# EAGLE design EasyDriverTip122 (EAGLE 7.2.0)
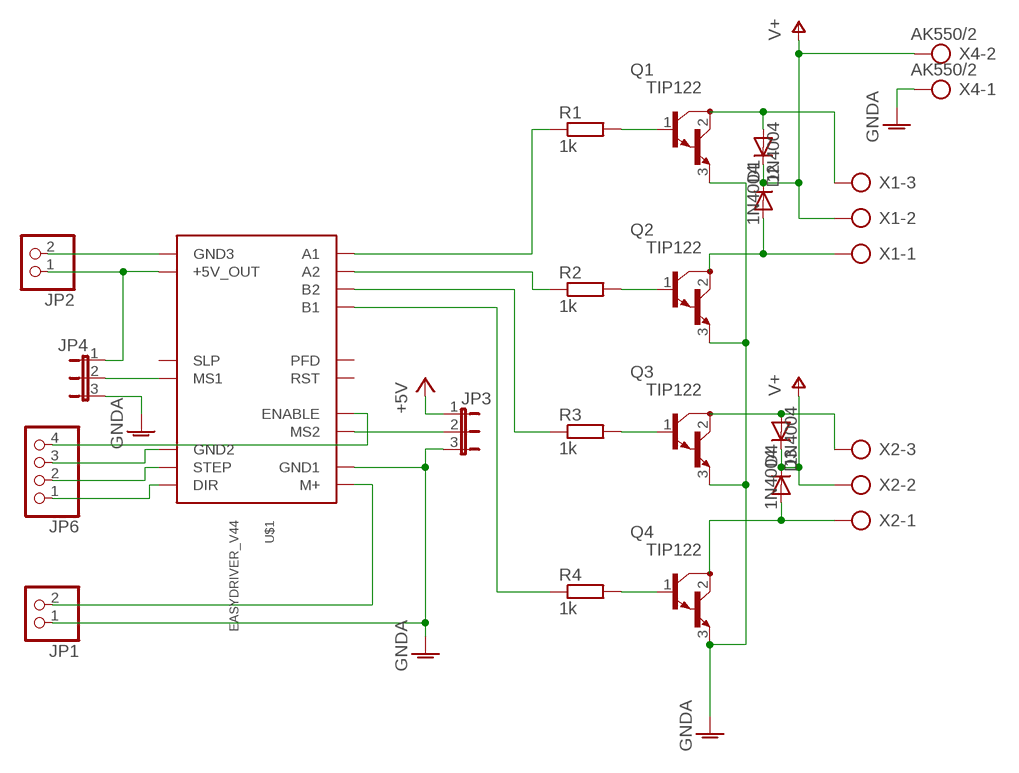
[diagram p0: schematic, sheet 1]

## Parts
D1  1N4004  [DO41-10]
D2  1N4004  [DO41-10]
D3  1N4004  [DO41-10]
D4  1N4004  [DO41-10]
JP1  PINHD-1X2  [1X02]
JP2  PINHD-1X2  [1X02]
JP3  JP2E  [JP2]
JP4  JP2E  [JP2]
JP6  PINHD-1X4  [1X04]
Q1  TIP122  [TO220V]
Q2  TIP122  [TO220V]
Q3  TIP122  [TO220V]
Q4  TIP122  [TO220V]
R1  1k  R-EU_0204/7  [0204/7]
R2  1k  R-EU_0204/7  [0204/7]
R3  1k  R-EU_0204/7  [0204/7]
R4  1k  R-EU_0204/7  [0204/7]
U$1  EASYDRIVER_V44  [EASYDRIVER_V44]
X1  AK500/3  [AK500/3]
X2  AK500/3  [AK500/3]
X4  AK550/2  [AK550/2]

## Nets
+5V: JP2.1 JP3.1 JP4.1 U$1.P$11(+5V_OUT)
GNDA: JP1.1 JP3.3 JP4.3 Q1.3(E) Q2.3(E) Q3.3(E) Q4.3(E) U$1.GND1 X4.1
N$1: JP4.2 U$1.MS1
N$2: JP3.2 U$1.MS2
N$3: JP6.3 U$1.GND2
N$4: JP6.2 U$1.STEP
N$5: JP6.4 U$1.ENABLE
N$6: JP1.2 U$1.M+
N$7: JP2.2 U$1.GND3
N$8: JP6.1 U$1.DIR
N$9: Q1.1(B) R1.2
N$10: Q2.1(B) R2.2
N$11: Q3.1(B) R3.2
N$12: Q4.1(B) R4.2
N$13: R1.1 U$1.A1
N$14: R2.1 U$1.A2
N$15: R3.1 U$1.B2
N$16: R4.1 U$1.B1
N$17: D2.A Q1.2(C) X1.3
N$18: D1.A Q2.2(C) X1.1
N$19: D3.A Q3.2(C) X2.3
N$20: D4.A Q4.2(C) X2.1
V+: D1.C D2.C D3.C D4.C X1.2 X2.2 X4.2
Unconnected: U$1.PFD U$1.RST U$1.SLEEP(SLP)

## Library data of the parts
D1-D4 = diode:1N4004: DIODE general purpose rectifier, 1 A
JP1 JP2 = pinhead:PINHD-1X2: PIN HEADER
JP3 JP4 = jumper:JP2E: JUMPER
JP6 = pinhead:PINHD-1X4: PIN HEADER
Q1-Q4 = transistor-npn:TIP122*: NPN Darlington Transistor
R1-R4 = resistor:R-EU_: RESISTOR, European symbol
U$1 = EasyDriver:EASYDRIVER_V44: EasyDriver version 4.4 - http://www.schmalzhaus.com/EasyDriver
X1 X2 = con-ptr500:AK500/3: CONNECTOR; OC_FARNELL: unknown; OC_NEWARK: unknown
X4 = con-ptr500:AK550/2: CONNECTOR; OC_FARNELL: unknown; OC_NEWARK: unknown

## Board
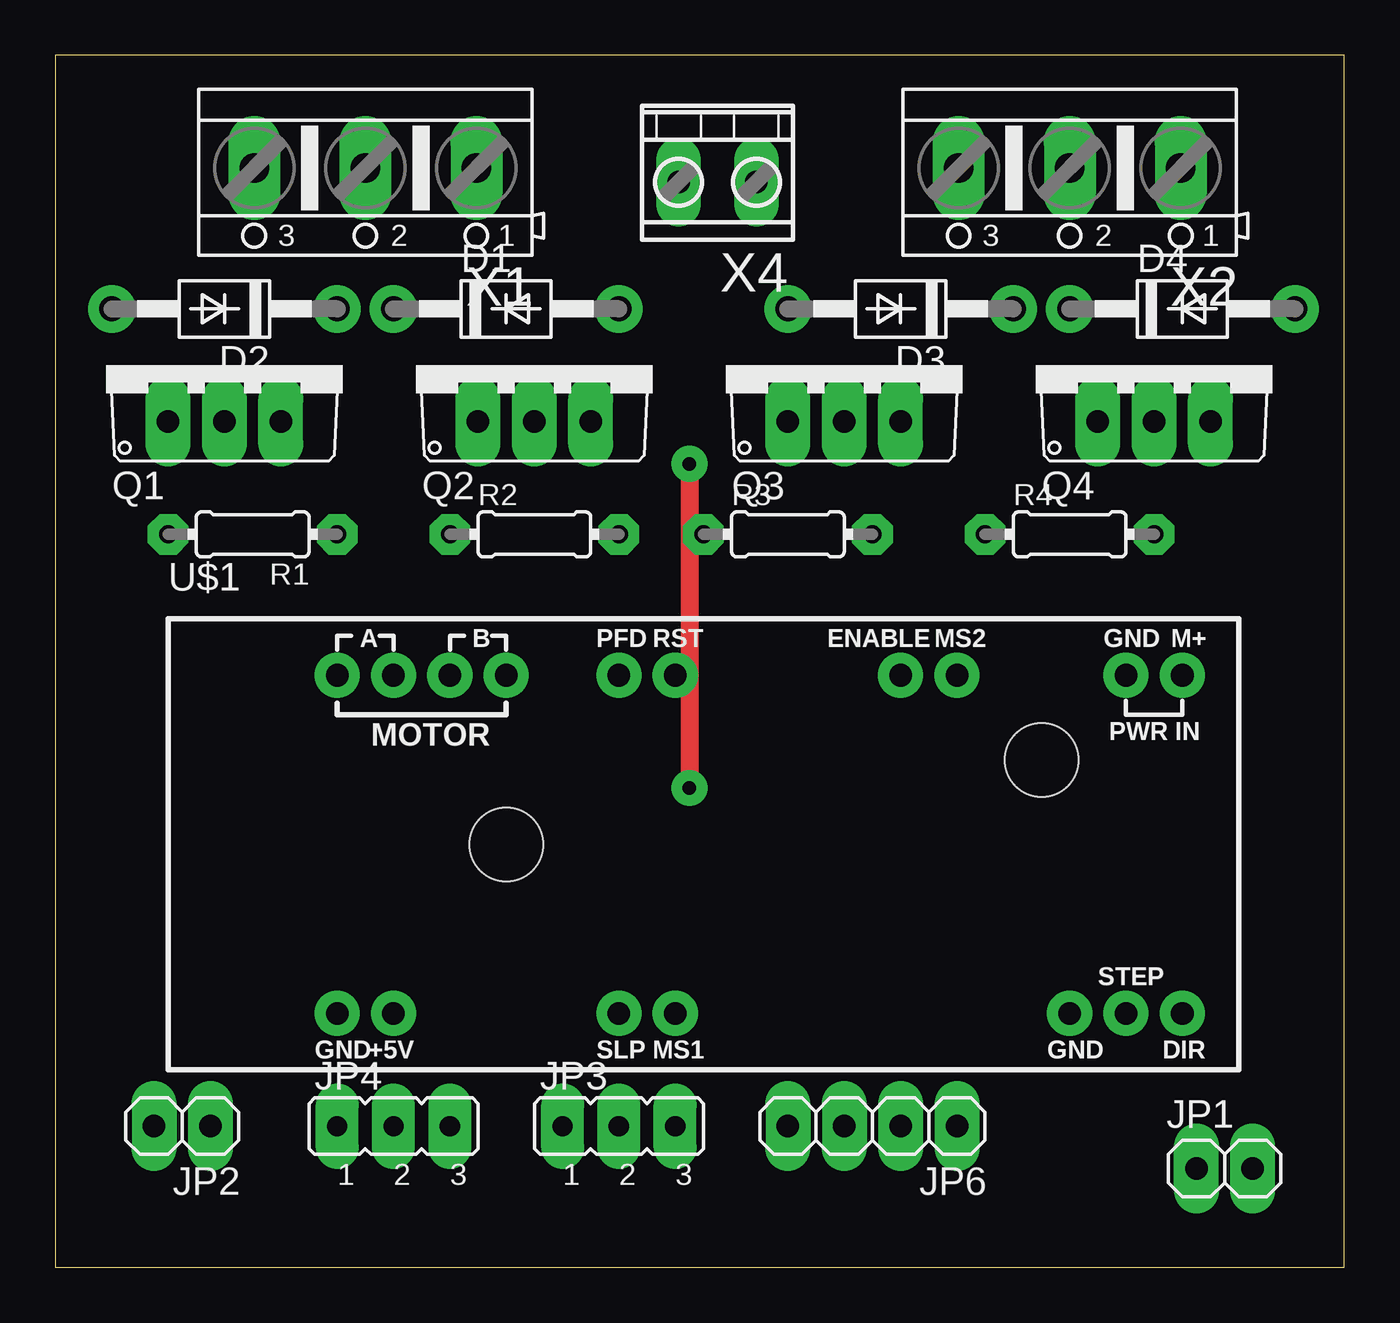
[diagram p1: board, top side]
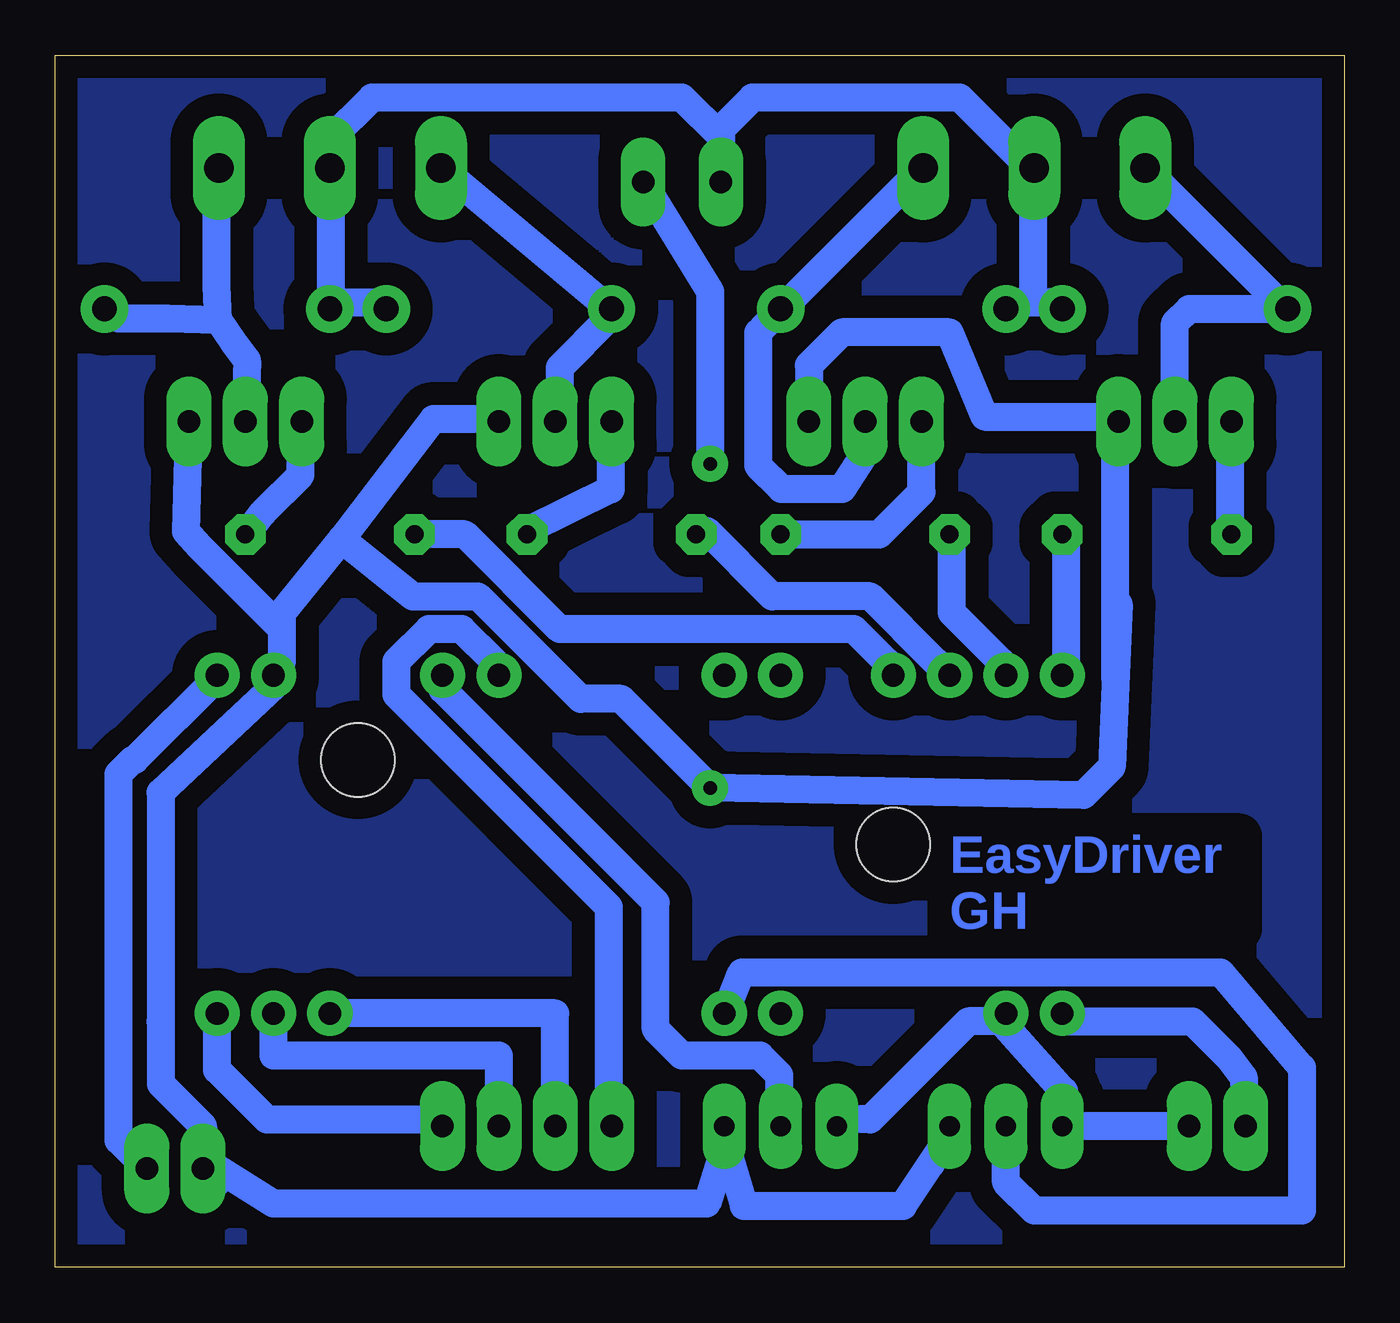
[diagram p2: board, bottom side, seen from below]

Size 58.09 x 54.6 mm. Coordinates in mm from the lower left corner, seen from the top.
Outline: 0,0 58.09,0 58.09,54.6 0,54.6 0,0
Copper layers (1*16): Top 0.035mm / dielectric 1.5mm / Bottom 0.035mm
Design rules "default *": minimum track width 50mil, minimum drill 50mil, track to track 8mil, track to pad 8mil, pad to pad 8mil, via to via 8mil, smd to smd 8mil, copper to edge 40mil, drill to drill 8mil, minimum pad ring 20mil, minimum via ring 20mil, stop-mask expansion 4mil, vias tented up to drill 0mil, thermal gap 10mil

### Footprints (pad centres in the part's own frame; a part is rotated, then mirrored left to right if it is on the bottom)
DO41-10 = drill 1.118: A 5.08,0; C -5.08,0
1X02 = drill 1.016 long: 1 -1.27,0; 2 1.27,0
JP2 = drill 0.914 long: 1 -2.54,0; 2 0,0; 3 2.54,0
1X04 = drill 1.016 long: 1 -3.81,0; 2 -1.27,0; 3 1.27,0; 4 3.81,0
TO220V = drill 1.016 long: 1 -2.54,-2.54; 2 0,-2.54; 3 2.54,-2.54
0204/7 = drill 0.813 octagon: 1 -3.81,0; 2 3.81,0
EASYDRIVER_V44 = drill 1.016 pad 1.88: A1 -16.51,7.62; A2 -13.97,7.62; B1 -8.89,7.62; B2 -11.43,7.62; DIR 21.59,-7.62; ENABLE 8.89,7.62; GND1 19.05,7.62; GND2 16.51,-7.62; GND3 -16.51,-7.62; M+ 21.59,7.62; MS1 -1.27,-7.62; MS2 11.43,7.62; P$11 -13.97,-7.62; PFD -3.81,7.62; RST -1.27,7.62; SLEEP -3.81,-7.62; STEP 19.05,-7.62 | hole 3.302: 15.24,3.81; -8.89,0
AK500/3 = drill 1.321 long: 1 -5.004,0; 2 0,0; 3 5.004,0
AK550/2 = drill 1 pad 1.5 long: 1 -1.75,0; 2 1.75,0

### Placement (x,y rotation side)
D1  20.32,43.18 0 top
D2  7.62,43.18 180 top
D3  38.1,43.18 180 top
D4  50.8,43.18 0 top
JP1  52.7,4.44 0 top
JP2  5.71,6.35 180 top
JP3  25.4,6.35 0 top
JP4  15.24,6.35 0 top
JP6  36.83,6.35 180 top
Q1  7.62,40.64 0 top
Q2  21.59,40.64 0 top
Q3  35.56,40.64 0 top
Q4  49.53,40.64 0 top
R1  8.89,33.02 180 top
R2  21.59,33.02 0 top
R3  33.02,33.02 0 top
R4  45.72,33.02 0 top
U$1  29.21,19.05 0 top
X1  13.97,49.53 180 top
X2  45.72,49.53 180 top
X4  29.84,48.9 180 top

### Tracks (layer width: path | path; a pad name or v marks a point on that pad's centre or on a via)
+5V
  Bottom 1.27: JP2.1 7.37,6.34 12.52,6.34 JP4.1 12.62,7.92 12.62,7.91 15.47,11.07 | 15.47,11.07 16.94,11.07 21.36,6.65 22.84,6.65 JP3.1 | 15.47,11.07 U$1.P$11
GND
  pour Bottom (isolate 1.016): 0.64,53.97 0.64,0.63 57.15,0.63 57.78,0.63 57.78,53.97
GNDA  (via drill 0.6)
  Top 0.813: v28.57,36.2 v28.57,21.59
  Bottom 1.27: JP4.3 17.78,5.92 18.62,4.65 19.88,2.76 27.05,2.76 27.99,5.92 JP3.3 27.99,5.18 28.73,2.86 48.26,2.86 50.8,4.44 JP1.1 | 45.2,32.8 47.88,29.49 47.88,28.75 | 45.2,32.8 41.05,38.23 38.3,38.23 Q3.3 | 47.88,28.75 47.88,27.28 U$1.GND1 47.88,26.54 53.35,21.39 53.35,11.07 53.34,10.77 53.34,8.26 51.44,6.35 JP1.1 | 47.88,28.75 51.56,32.44 52.2,33.15 Q4.3 | 45.2,32.8 41.99,30.23 39.04,30.23 34.42,25.6 32.59,25.6 v28.57,21.59 11.75,21.27 10.48,22.54 10.16,29.88 10.31,26.54 10.31,37.59 Q1.3 10.31,38.33 16.2,38.33 17.78,42.13 22.64,42.13 24.13,40.64 Q2.3 | v28.57,36.2 28.57,43.97 X4.1 | 50.8,3.81 JP1.1
N$1
  Bottom 1.27: U$1.MS1 27.99,11.18 27.15,13.28 5.56,13.28 1.91,8.99 1.91,2.54 13.97,2.54 15.24,3.81 JP4.2
N$2
  Bottom 1.27: JP3.2 25.46,7.92 25.46,8.66 26.33,9.53 29.84,9.53 31.04,10.72 31.04,16.43 40.64,26.04 U$1.MS2
N$3
  Bottom 1.27: JP6.3 35.56,11.43 U$1.GND2
N$4
  Bottom 1.27: JP6.2 38.1,9.53 48.26,9.53 U$1.STEP
N$5
  Bottom 1.27: JP6.4 33.15,6.65 33.15,16.23 42.72,25.81 42.72,27.28 41.25,28.75 39.78,28.75 38.3,27.28 U$1.ENABLE
N$6
  Bottom 1.27: U$1.M+ 50.83,26.54 54.51,22.86 54.61,22.86 55.24,22.23 55.24,5.71 JP1.2
N$7
  Bottom 1.27: JP2.2 4.52,8.56 5.16,9.4 6.83,11.07 12.52,11.07 U$1.GND3
N$8
  Bottom 1.27: JP6.1 41.25,6.65 48.56,6.65 50.8,8.89 U$1.DIR
N$9
  Bottom 1.27: R1.2 5.16,33.17 5.16,37.59 Q1.1
N$10
  Bottom 1.27: R2.2 20.95,33.02 19.05,34.93 Q2.1
N$11
  Bottom 1.27: R3.2 36.83,33.17 33.05,35.05 Q3.1
N$12
  Bottom 1.27: R4.2 49.35,33.17 48.72,34.01 47.04,35.69 Q4.1
N$13
  Bottom 1.27: R1.1 12.52,32.44 12.52,27.28 U$1.A1
N$14
  Bottom 1.27: R2.1 17.68,32.44 17.68,29.49 15.47,27.28 U$1.A2
N$15
  Bottom 1.27: R3.1 28.73,33.17 25.78,30.23 21.36,30.23 18.41,27.28 U$1.B2
N$16
  Bottom 1.27: U$1.B1 20.62,27.28 22.1,28.75 35.36,28.75 39.62,33.02 R4.1
N$17
  Bottom 1.27: X1.3 8.84,49.38 2.95,43.48 D2.A 6.99,43.18 7.62,42.55 Q1.2
N$18
  Bottom 1.27: Q2.2 21.46,37.59 21.46,36.86 22.62,35.06 25.36,35.06 26.42,36.12 26.42,42.11 D1.A 25.04,43.48 19.15,49.38 X1.1
N$19
  Bottom 1.27: 33.15,42.75 32.88,43.02 40.51,49.38 X2.3 | 33.15,42.75 35.36,40.54 35.36,38.33 Q3.2 | 33.15,42.75 D3.A
N$20
  Bottom 1.27: 50.76,42.7 53.03,42.75 55.24,42.75 D4.A | 50.76,42.7 50.09,41.71 49.45,40.87 Q4.2 | 50.76,42.7 50.83,44.22 50.83,49.38 X2.1
V+
  Bottom 1.27: 45.67,43.48 43.46,43.48 D3.C | 45.67,43.48 45.67,49.38 X2.2 45.72,50.8 43.81,52.7 29.84,52.7 28.09,50.95 | 45.67,43.48 D4.C | 13.99,43.48 14.73,43.48 D1.C | 13.99,43.48 13.26,43.48 D2.C | 13.99,43.48 13.99,49.38 | 13.99,49.38 X1.2 | 13.99,49.38 17.32,52.7 26.67,52.7 28.09,51.28 28.09,50.95 | X4.2 28.09,49.53 28.09,50.95

### Text on the board
Bottom: EasyDriver / GH